# EAGLE design FeatherLargePrototype (EAGLE 7.4.0)
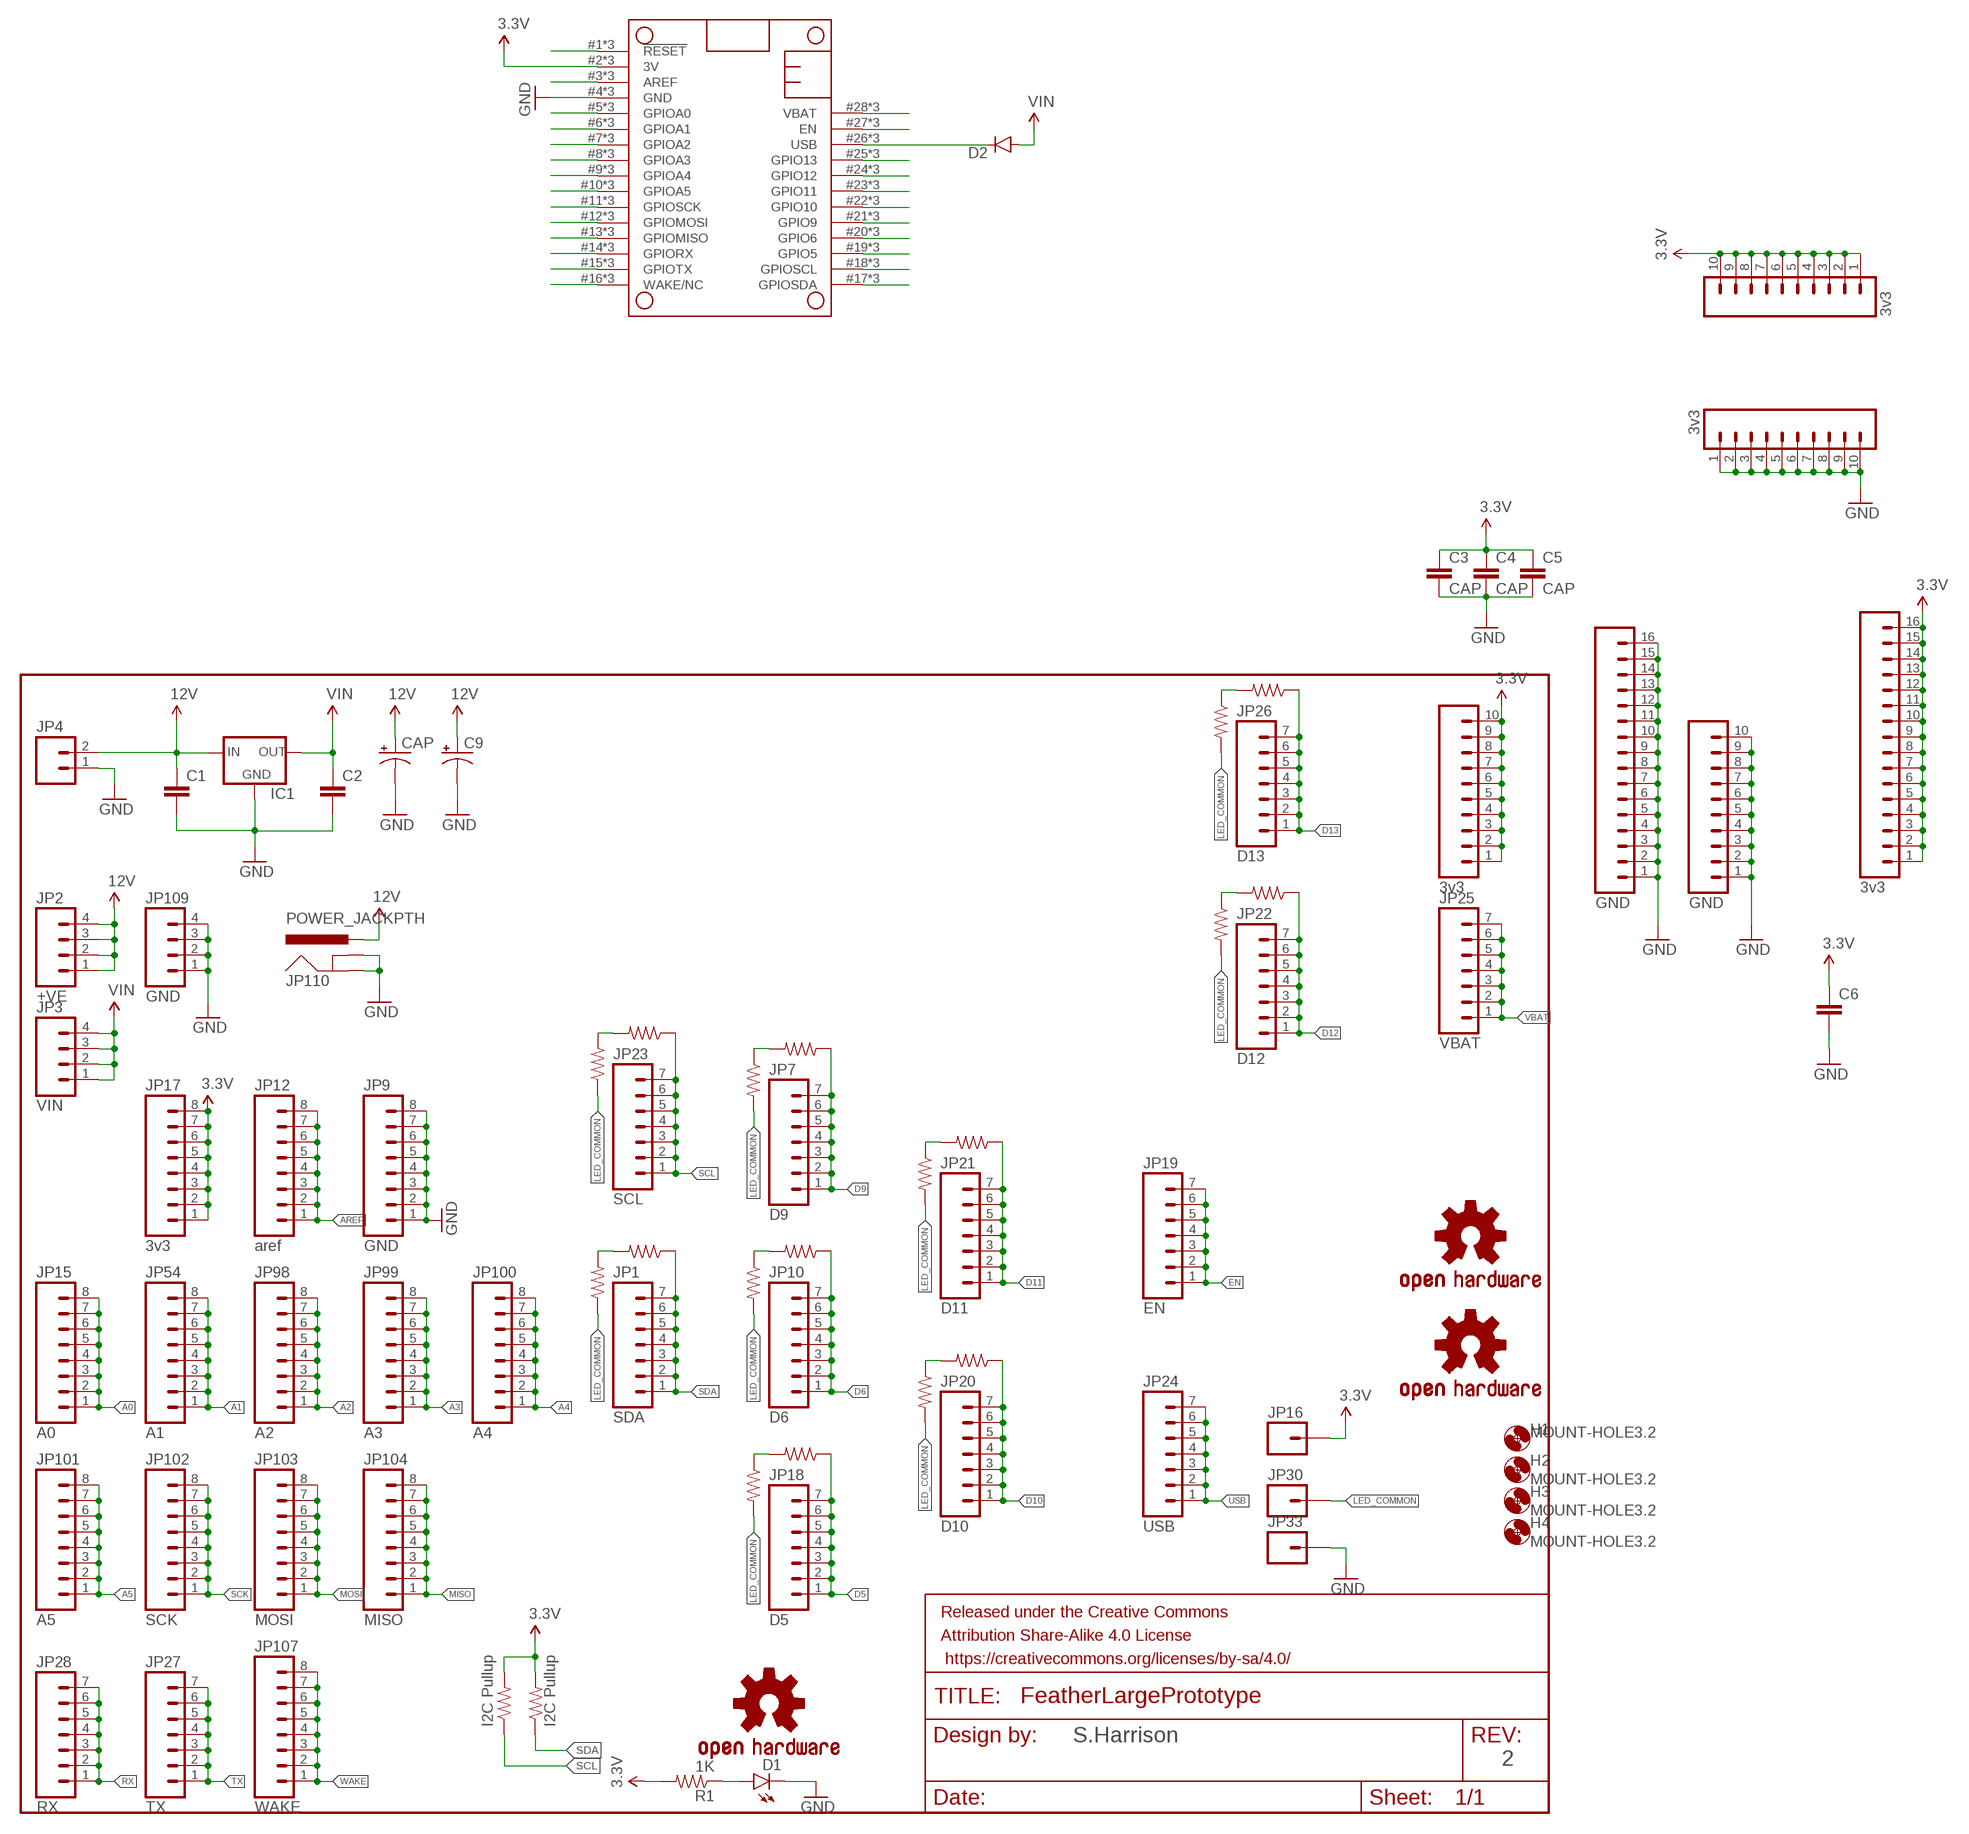
[diagram p0: schematic, sheet 1, part 1 of 2]
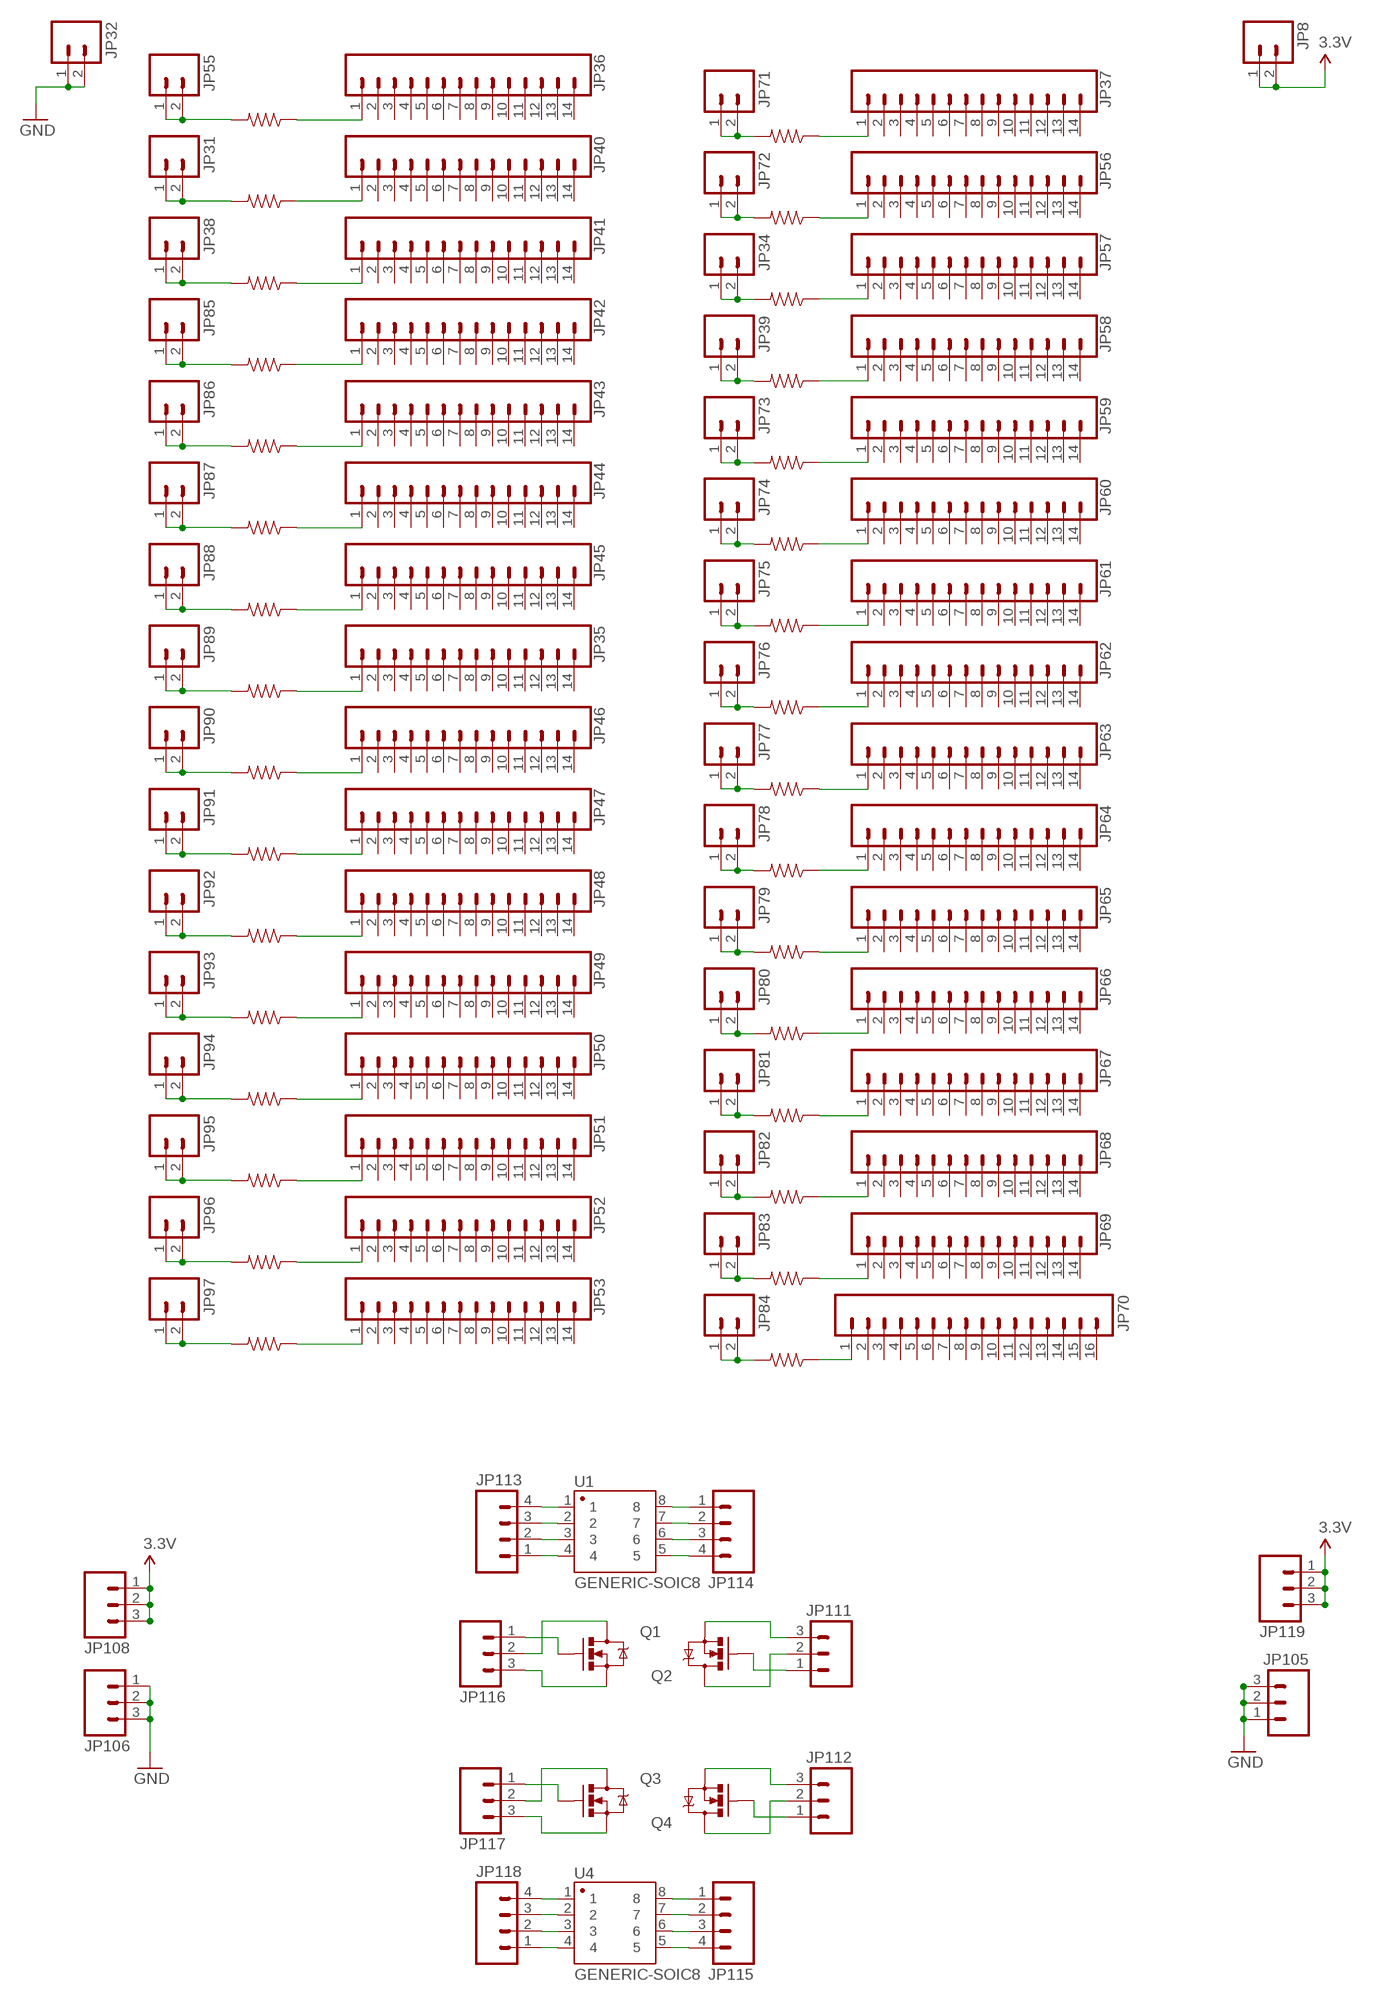
[diagram p1: schematic, sheet 1, part 2 of 2]

## Parts
C1  CAP1206  [1206]
C2  CAP1206  [1206]
C3  CAP  CAP1206  [1206]
C4  CAP  CAP1206  [1206]
C5  CAP  CAP1206  [1206]
C6  CAP1206  [1206]
C9  CAP_POL7343  [EIA7343]
CAP  CAP_POLPTH1  [CPOL-RADIAL-100UF-25V]
D1  LED1206-BOTTOM  [LED-1206-BOTTOM]
D2  DIODESMA-ALT  [SMA-DIODE_ALT]
FRAME1  FRAME-LETTER  [CREATIVE_COMMONS]
H1  MOUNT-HOLE3.2  [3,2]
H2  MOUNT-HOLE3.2  [3,2]
H3  MOUNT-HOLE3.2  [3,2]
H4  MOUNT-HOLE3.2  [3,2]
IC1  78XXS  [78XXS]
JP1  SDA  M07  [1X07]
JP2  +VE  M04PTH  [1X04]
JP3  VIN  M04PTH  [1X04]
JP4  M025MM  [SCREWTERMINAL-5MM-2]
JP5  3v3  M10SILK_FEMALE_PTH  [1X10]
JP6  3v3  M10SILK_FEMALE_PTH  [1X10]
JP7  D9  M07  [1X07]
JP8  M02PTH  [1X02]
JP9  GND  M08  [1X08_ROUND]
JP10  D6  M07  [1X07]
JP11  GND  M10SILK_FEMALE_PTH  [1X10]
JP12  aref  M08  [1X08_ROUND]
JP13  3v3  M16PTH  [1X16]
JP14  GND  M16PTH  [1X16]
JP15  A0  M08  [1X08_ROUND]
JP16  M01PTH  [1X01]
JP17  3v3  M08  [1X08_ROUND]
JP18  D5  M07  [1X07]
JP19  EN  M07  [1X07]
JP20  D10  M07  [1X07]
JP21  D11  M07  [1X07]
JP22  D12  M07  [1X07]
JP23  SCL  M07  [1X07]
JP24  USB  M07  [1X07]
JP25  VBAT  M07  [1X07]
JP26  D13  M07  [1X07]
JP27  TX  M07  [1X07]
JP28  RX  M07  [1X07]
JP29  3v3  M10SILK_FEMALE_PTH  [1X10]
JP30  M01PTH  [1X01]
JP31  M02PTH  [1X02]
JP32  M02PTH  [1X02]
JP33  M01PTH  [1X01]
JP34  M02PTH  [1X02]
JP35  CONN_14CONNECTED  [1X14_CONNECTED]
JP36  CONN_14CONNECTED  [1X14_CONNECTED]
JP37  CONN_14CONNECTED  [1X14_CONNECTED]
JP38  M02PTH  [1X02]
JP39  M02PTH  [1X02]
JP40  CONN_14CONNECTED  [1X14_CONNECTED]
JP41  CONN_14CONNECTED  [1X14_CONNECTED]
JP42  CONN_14CONNECTED  [1X14_CONNECTED]
JP43  CONN_14CONNECTED  [1X14_CONNECTED]
JP44  CONN_14CONNECTED  [1X14_CONNECTED]
JP45  CONN_14CONNECTED  [1X14_CONNECTED]
JP46  CONN_14CONNECTED  [1X14_CONNECTED]
JP47  CONN_14CONNECTED  [1X14_CONNECTED]
JP48  CONN_14CONNECTED  [1X14_CONNECTED]
JP49  CONN_14CONNECTED  [1X14_CONNECTED]
JP50  CONN_14CONNECTED  [1X14_CONNECTED]
JP51  CONN_14CONNECTED  [1X14_CONNECTED]
JP52  CONN_14CONNECTED  [1X14_CONNECTED]
JP53  CONN_14NO_SILK  [1X14_NO_SILK]
JP54  A1  M08  [1X08_ROUND]
JP55  M02PTH  [1X02]
JP56  CONN_14CONNECTED  [1X14_CONNECTED]
JP57  CONN_14CONNECTED  [1X14_CONNECTED]
JP58  CONN_14CONNECTED  [1X14_CONNECTED]
JP59  CONN_14CONNECTED  [1X14_CONNECTED]
JP60  CONN_14CONNECTED  [1X14_CONNECTED]
JP61  CONN_14CONNECTED  [1X14_CONNECTED]
JP62  CONN_14CONNECTED  [1X14_CONNECTED]
JP63  CONN_14CONNECTED  [1X14_CONNECTED]
JP64  CONN_14CONNECTED  [1X14_CONNECTED]
JP65  CONN_14CONNECTED  [1X14_CONNECTED]
JP66  CONN_14CONNECTED  [1X14_CONNECTED]
JP67  CONN_14CONNECTED  [1X14_CONNECTED]
JP68  CONN_14CONNECTED  [1X14_CONNECTED]
JP69  CONN_14CONNECTED  [1X14_CONNECTED]
JP70  M161X16_NO_SILK  [1X16_NO_SILK]
JP71  M02PTH  [1X02]
JP72  M02PTH  [1X02]
JP73  M02PTH  [1X02]
JP74  M02PTH  [1X02]
JP75  M02PTH  [1X02]
JP76  M02PTH  [1X02]
JP77  M02PTH  [1X02]
JP78  M02PTH  [1X02]
JP79  M02PTH  [1X02]
JP80  M02PTH  [1X02]
JP81  M02PTH  [1X02]
JP82  M02PTH  [1X02]
JP83  M02PTH  [1X02]
JP84  M02PTH  [1X02]
JP85  M02PTH  [1X02]
JP86  M02PTH  [1X02]
JP87  M02PTH  [1X02]
JP88  M02PTH  [1X02]
JP89  M02PTH  [1X02]
JP90  M02PTH  [1X02]
JP91  M02PTH  [1X02]
JP92  M02PTH  [1X02]
JP93  M02PTH  [1X02]
JP94  M02PTH  [1X02]
JP95  M02PTH  [1X02]
JP96  M02PTH  [1X02]
JP97  M02PTH  [1X02]
JP98  A2  M08  [1X08_ROUND]
JP99  A3  M08  [1X08_ROUND]
JP100  A4  M08  [1X08_ROUND]
JP101  A5  M08  [1X08_ROUND]
JP102  SCK  M08  [1X08_ROUND]
JP103  MOSI  M08  [1X08_ROUND]
JP104  MISO  M08  [1X08_ROUND]
JP105  M03PTH  [1X03]
JP106  M03PTH  [1X03]
JP107  WAKE  M08  [1X08_ROUND]
JP108  M03PTH  [1X03]
JP109  GND  M04PTH  [1X04]
JP110  POWER_JACKPTH  [POWER_JACK_PTH]
JP111  M03PTH  [1X03]
JP112  M03PTH  [1X03]
JP113  M04NO_SILK_ALL_ROUND  [1X04_NO_SILK_ALL_ROUND]
JP114  M04NO_SILK_ALL_ROUND  [1X04_NO_SILK_ALL_ROUND]
JP115  M04NO_SILK_ALL_ROUND  [1X04_NO_SILK_ALL_ROUND]
JP116  M03PTH  [1X03]
JP117  M03PTH  [1X03]
JP118  M04NO_SILK_ALL_ROUND  [1X04_NO_SILK_ALL_ROUND]
JP119  M03PTH  [1X03]
LOGO1  OSHW-LOGOL  [OSHW-LOGO-L]
LOGO2  OSHW-LOGOL  [OSHW-LOGO-L]
LOGO3  OSHW-LOGOM  [OSHW-LOGO-M]
MS2  FEATHERWINGFEATHEWING_BREAKOUT  [FEATHERWING_BREAKOUT]
Q1  MOSFET-NCHANNELBSS123LT1G  [SOT23-3]
Q2  MOSFET-NCHANNELBSS123LT1G  [SOT23-3]
Q3  MOSFET-NCHANNELBSS123LT1G  [SOT23-3]
Q4  MOSFET-NCHANNELBSS123LT1G  [SOT23-3]
R1  1K  RESISTOR1206  [1206]
R10  RESISTOR1206  [1206]
R11  RESISTOR1206  [1206]
R12  RESISTOR1206  [1206]
R13  RESISTOR1206  [1206]
R14  RESISTOR1206  [1206]
R15  RESISTOR1206  [1206]
R16  RESISTOR1206  [1206]
R17  RESISTOR1206  [1206]
R18  RESISTOR1206  [1206]
R19  RESISTOR1206  [1206]
R20  RESISTOR1206  [1206]
R21  RESISTOR1206  [1206]
R22  RESISTOR1206  [1206]
R23  RESISTOR1206  [1206]
R24  RESISTOR1206  [1206]
R25  RESISTOR1206  [1206]
R26  RESISTOR1206  [1206]
R27  RESISTOR1206  [1206]
R30  RESISTOR1206  [1206]
R31  RESISTOR1206  [1206]
R32  RESISTOR1206  [1206]
R33  RESISTOR1206  [1206]
R34  RESISTOR1206  [1206]
R35  RESISTOR1206  [1206]
R36  RESISTOR1206  [1206]
R37  RESISTOR1206  [1206]
R38  RESISTOR1206  [1206]
R39  RESISTOR1206  [1206]
R40  RESISTOR1206  [1206]
R41  RESISTOR1206  [1206]
R42  RESISTOR1206  [1206]
R43  RESISTOR1206  [1206]
R44  RESISTOR1206  [1206]
R45  RESISTOR1206  [1206]
R46  RESISTOR1206  [1206]
R47  RESISTOR1206  [1206]
R48  RESISTOR1206  [1206]
R49  RESISTOR1206  [1206]
R50  RESISTOR1206  [1206]
R51  RESISTOR1206  [1206]
R52  RESISTOR1206  [1206]
R53  RESISTOR1206  [1206]
R54  RESISTOR1206  [1206]
R55  RESISTOR1206  [1206]
R56  RESISTOR1206  [1206]
R57  RESISTOR1206  [1206]
R58  RESISTOR1206  [1206]
R59  RESISTOR1206  [1206]
R60  RESISTOR1206  [1206]
R61  RESISTOR1206  [1206]
R62  I2C Pullup  RESISTOR1206  [1206]
R63  I2C Pullup  RESISTOR1206  [1206]
U1  GENERIC-SOIC8  [SO08-UNIVERSAL]
U4  GENERIC-SOIC8  [SO08-UNIVERSAL]

## Nets
3.3V: C3.1 C4.1 C5.1 C6.1 JP5.1 JP5.2 JP5.3 JP5.4 JP5.5 JP5.6 JP5.7 JP5.8 JP5.9 JP5.10 JP6.1 JP6.2 JP6.3 JP6.4 JP6.5 JP6.6 JP6.7 JP6.8 JP6.9 JP6.10 JP8.1 JP8.2 JP13.1 JP13.2 JP13.3 JP13.4 JP13.5 JP13.6 JP13.7 JP13.8 JP13.9 JP13.10 JP13.11 JP13.12 JP13.13 JP13.14 JP13.15 JP13.16 JP16.1 JP17.1 JP17.2 JP17.3 JP17.4 JP17.5 JP17.6 JP17.7 JP17.8 JP108.1 JP108.2 JP108.3 JP119.1 JP119.2 JP119.3 MS2.2(3V) MS2.#2(3V) MS2.@2(3V) R1.2 R62.2 R63.2
12V: C1.1 C9.A(+) CAP.1(+) IC1.IN JP2.1 JP2.2 JP2.3 JP2.4 JP4.2 JP110.PWR
A0: JP15.1 JP15.2 JP15.3 JP15.4 JP15.5 JP15.6 JP15.7 JP15.8 MS2.5(GPIOA0) MS2.#5(GPIOA0) MS2.@5(GPIOA0)
A1: JP54.1 JP54.2 JP54.3 JP54.4 JP54.5 JP54.6 JP54.7 JP54.8 MS2.6(GPIOA1) MS2.#6(GPIOA1) MS2.@6(GPIOA1)
A2: JP98.1 JP98.2 JP98.3 JP98.4 JP98.5 JP98.6 JP98.7 JP98.8 MS2.7(GPIOA2) MS2.#7(GPIOA2) MS2.@7(GPIOA2)
A3: JP99.1 JP99.2 JP99.3 JP99.4 JP99.5 JP99.6 JP99.7 JP99.8 MS2.8(GPIOA3) MS2.#8(GPIOA3) MS2.@8(GPIOA3)
A4: JP100.1 JP100.2 JP100.3 JP100.4 JP100.5 JP100.6 JP100.7 JP100.8 MS2.9(GPIOA4) MS2.#9(GPIOA4) MS2.@9(GPIOA4)
A5: JP101.1 JP101.2 JP101.3 JP101.4 JP101.5 JP101.6 JP101.7 JP101.8 MS2.10(GPIOA5) MS2.#10(GPIOA5) MS2.@10(GPIOA5)
AREF: JP12.1 JP12.2 JP12.3 JP12.4 JP12.5 JP12.6 JP12.7 JP12.8 MS2.3(AREF) MS2.#3(AREF) MS2.@3(AREF)
D5: JP18.1 JP18.2 JP18.3 JP18.4 JP18.5 JP18.6 JP18.7 MS2.19(GPIO5) MS2.#19(GPIO5) MS2.@19(GPIO5) R22.1
D6: JP10.1 JP10.2 JP10.3 JP10.4 JP10.5 JP10.6 JP10.7 MS2.20(GPIO6) MS2.#20(GPIO6) MS2.@20(GPIO6) R20.1
D9: JP7.1 JP7.2 JP7.3 JP7.4 JP7.5 JP7.6 JP7.7 MS2.21(GPIO9) MS2.#21(GPIO9) MS2.@21(GPIO9) R18.1
D10: JP20.1 JP20.2 JP20.3 JP20.4 JP20.5 JP20.6 JP20.7 MS2.22(GPIO10) MS2.#22(GPIO10) MS2.@22(GPIO10) R16.1
D11: JP21.1 JP21.2 JP21.3 JP21.4 JP21.5 JP21.6 JP21.7 MS2.23(GPIO11) MS2.#23(GPIO11) MS2.@23(GPIO11) R14.1
D12: JP22.1 JP22.2 JP22.3 JP22.4 JP22.5 JP22.6 JP22.7 MS2.24(GPIO12) MS2.#24(GPIO12) MS2.@24(GPIO12) R12.1
D13: JP26.1 JP26.2 JP26.3 JP26.4 JP26.5 JP26.6 JP26.7 MS2.25(GPIO13) MS2.#25(GPIO13) MS2.@25(GPIO13) R10.1
EN: JP19.1 JP19.2 JP19.3 JP19.4 JP19.5 JP19.6 JP19.7 MS2.27(EN) MS2.#27(EN) MS2.@27(EN)
GND: C1.2 C2.2 C3.2 C4.2 C5.2 C6.2 C9.C(-) CAP.2(-) D1.C IC1.GND JP4.1 JP9.1 JP9.2 JP9.3 JP9.4 JP9.5 JP9.6 JP9.7 JP9.8 JP11.1 JP11.2 JP11.3 JP11.4 JP11.5 JP11.6 JP11.7 JP11.8 JP11.9 JP11.10 JP14.1 JP14.2 JP14.3 JP14.4 JP14.5 JP14.6 JP14.7 JP14.8 JP14.9 JP14.10 JP14.11 JP14.12 JP14.13 JP14.14 JP14.15 JP14.16 JP29.1 JP29.2 JP29.3 JP29.4 JP29.5 JP29.6 JP29.7 JP29.8 JP29.9 JP29.10 JP32.1 JP32.2 JP33.1 JP105.1 JP105.2 JP105.3 JP106.1 JP106.2 JP106.3 JP109.1 JP109.2 JP109.3 JP109.4 JP110.GND JP110.GNDBREAK MS2.4(GND) MS2.#4(GND) MS2.@4(GND)
LED_COMMON: JP30.1 R11.2 R13.2 R15.2 R17.2 R19.2 R21.2 R23.2 R25.1 R27.1
MISO: JP104.1 JP104.2 JP104.3 JP104.4 JP104.5 JP104.6 JP104.7 JP104.8 MS2.13(GPIOMISO) MS2.#13(GPIOMISO) MS2.@13(GPIOMISO)
MOSI: JP103.1 JP103.2 JP103.3 JP103.4 JP103.5 JP103.6 JP103.7 JP103.8 MS2.12(GPIOMOSI) MS2.#12(GPIOMOSI) MS2.@12(GPIOMOSI)
N$1: D1.A R1.1
N$2: JP113.4 U1.1
N$3: JP113.3 U1.2
N$6: R10.2 R11.1
N$7: JP113.2 U1.3
N$8: JP113.1 U1.4
N$9: JP114.1 U1.8
N$12: JP114.2 U1.7
N$13: R12.2 R13.1
N$14: R14.2 R15.1
N$15: R16.2 R17.1
N$16: JP114.3 U1.6
N$17: JP114.4 U1.5
N$18: JP112.3 Q4.2(S)
N$19: R18.2 R19.1
N$20: JP116.2 Q1.3(D)
N$21: R20.2 R21.1
N$22: JP116.1 Q1.1(G)
N$23: R22.2 R23.1
N$25: JP71.1 JP71.2 R46.2
N$26: JP116.3 Q1.2(S)
N$27: R26.2 R27.2
N$29: R24.2 R25.2
N$30: JP117.2 Q3.3(D)
N$31: JP72.1 JP72.2 R47.2
N$32: JP34.1 JP34.2 R48.2
N$33: JP39.1 JP39.2 R49.2
N$34: JP73.1 JP73.2 R50.2
N$35: JP74.1 JP74.2 R51.2
N$36: JP75.1 JP75.2 R52.2
N$37: JP76.1 JP76.2 R53.2
N$38: JP77.1 JP77.2 R54.2
N$39: JP78.1 JP78.2 R55.2
N$40: JP79.1 JP79.2 R56.2
N$41: JP80.1 JP80.2 R57.2
N$42: JP81.1 JP81.2 R58.2
N$43: JP82.1 JP82.2 R59.2
N$44: JP83.1 JP83.2 R60.2
N$45: JP84.1 JP84.2 R61.2
N$46: JP70.1 R61.1
N$47: JP69.1 R60.1
N$48: JP68.1 R59.1
N$49: JP67.1 R58.1
N$50: JP66.1 R57.1
N$51: JP65.1 R56.1
N$52: JP64.1 R55.1
N$53: JP63.1 R54.1
N$54: JP62.1 R53.1
N$55: JP61.1 R52.1
N$56: JP60.1 R51.1
N$57: JP59.1 R50.1
N$58: JP58.1 R49.1
N$59: JP57.1 R48.1
N$60: JP56.1 R47.1
N$61: JP37.1 R46.1
N$62: JP97.1 JP97.2 R45.2
N$63: JP96.1 JP96.2 R44.2
N$64: JP95.1 JP95.2 R43.2
N$65: JP94.1 JP94.2 R42.2
N$66: JP93.1 JP93.2 R41.2
N$67: JP92.1 JP92.2 R40.2
N$68: JP91.1 JP91.2 R39.2
N$69: JP90.1 JP90.2 R38.2
N$70: JP89.1 JP89.2 R37.2
N$71: JP88.1 JP88.2 R36.2
N$72: JP87.1 JP87.2 R35.2
N$73: JP86.1 JP86.2 R34.2
N$74: JP85.1 JP85.2 R33.2
N$75: JP38.1 JP38.2 R32.2
N$76: JP55.1 JP55.2 R30.2
N$77: JP36.1 R30.1
N$78: JP40.1 R31.1
N$79: JP41.1 R32.1
N$80: JP42.1 R33.1
N$81: JP43.1 R34.1
N$82: JP44.1 R35.1
N$83: JP45.1 R36.1
N$84: JP35.1 R37.1
N$85: JP46.1 R38.1
N$86: JP47.1 R39.1
N$87: JP48.1 R40.1
N$88: JP49.1 R41.1
N$89: JP50.1 R42.1
N$90: JP51.1 R43.1
N$91: JP52.1 R44.1
N$92: JP53.1 R45.1
N$93: JP31.1 JP31.2 R31.2
N$95: JP117.1 Q3.1(G)
N$96: JP117.3 Q3.2(S)
N$97: JP118.4 U4.1
N$98: JP118.3 U4.2
N$104: JP118.2 U4.3
N$128: JP118.1 U4.4
N$129: JP115.1 U4.8
N$130: JP115.2 U4.7
N$131: JP115.3 U4.6
N$132: JP115.4 U4.5
N$134: JP112.2 Q4.3(D)
N$135: JP112.1 Q4.1(G)
N$138: JP111.2 Q2.3(D)
N$139: JP111.1 Q2.1(G)
N$140: JP111.3 Q2.2(S)
RESET: MS2.1(!RESET) MS2.#1(!RESET) MS2.@1(!RESET)
RX: JP28.1 JP28.2 JP28.3 JP28.4 JP28.5 JP28.6 JP28.7 MS2.14(GPIORX) MS2.#14(GPIORX) MS2.@14(GPIORX)
SCK: JP102.1 JP102.2 JP102.3 JP102.4 JP102.5 JP102.6 JP102.7 JP102.8 MS2.11(GPIOSCK) MS2.#11(GPIOSCK) MS2.@11(GPIOSCK)
SCL: JP23.1 JP23.2 JP23.3 JP23.4 JP23.5 JP23.6 JP23.7 MS2.18(GPIOSCL) MS2.#18(GPIOSCL) MS2.@!8(GPIOSCL) R24.1 R62.1
SDA: JP1.1 JP1.2 JP1.3 JP1.4 JP1.5 JP1.6 JP1.7 MS2.17(GPIOSDA) MS2.#17(GPIOSDA) MS2.@17(GPIOSDA) R26.1 R63.1
TX: JP27.1 JP27.2 JP27.3 JP27.4 JP27.5 JP27.6 JP27.7 MS2.15(GPIOTX) MS2.#15(GPIOTX) MS2.@15(GPIOTX)
USB: D2.C JP24.1 JP24.2 JP24.3 JP24.4 JP24.5 JP24.6 JP24.7 MS2.26(USB) MS2.#26(USB) MS2.@26(USB)
VBAT: JP25.1 JP25.2 JP25.3 JP25.4 JP25.5 JP25.6 JP25.7 MS2.28(VBAT) MS2.#28(VBAT) MS2.@28(VBAT)
VIN: C2.1 D2.A IC1.OUT JP3.1 JP3.2 JP3.3 JP3.4
WAKE: JP107.1 JP107.2 JP107.3 JP107.4 JP107.5 JP107.6 JP107.7 JP107.8 MS2.16(WAKE/NC) MS2.#16(WAKE/NC) MS2.@16(WAKE/NC)
Unconnected: JP35.2 JP35.3 JP35.4 JP35.5 JP35.6 JP35.7 JP35.8 JP35.9 JP35.10 JP35.11 JP35.12 JP35.13 JP35.14 JP36.2 JP36.3 JP36.4 JP36.5 JP36.6 JP36.7 JP36.8 JP36.9 JP36.10 JP36.11 JP36.12 JP36.13 JP36.14 JP37.2 JP37.3 JP37.4 JP37.5 JP37.6 JP37.7 JP37.8 JP37.9 JP37.10 JP37.11 JP37.12 JP37.13 JP37.14 JP40.2 JP40.3 JP40.4 JP40.5 JP40.6 JP40.7 JP40.8 JP40.9 JP40.10 JP40.11 JP40.12 JP40.13 JP40.14 JP41.2 JP41.3 JP41.4 JP41.5 JP41.6 JP41.7 JP41.8 JP41.9 JP41.10 JP41.11 JP41.12 JP41.13 JP41.14 JP42.2 JP42.3 JP42.4 JP42.5 JP42.6 JP42.7 JP42.8 JP42.9 JP42.10 JP42.11 JP42.12 JP42.13 JP42.14 JP43.2 JP43.3 JP43.4 JP43.5 JP43.6 JP43.7 JP43.8 JP43.9 JP43.10 JP43.11 JP43.12 JP43.13 JP43.14 JP44.2 JP44.3 JP44.4 JP44.5 JP44.6 JP44.7 JP44.8 JP44.9 JP44.10 JP44.11 JP44.12 JP44.13 JP44.14 JP45.2 JP45.3 JP45.4 JP45.5 JP45.6 JP45.7 JP45.8 JP45.9 JP45.10 JP45.11 JP45.12 JP45.13 JP45.14 JP46.2 JP46.3 JP46.4 JP46.5 JP46.6 JP46.7 JP46.8 JP46.9 JP46.10 JP46.11 JP46.12 JP46.13 JP46.14 JP47.2 JP47.3 JP47.4 JP47.5 JP47.6 JP47.7 JP47.8 JP47.9 JP47.10 JP47.11 JP47.12 JP47.13 JP47.14 JP48.2 JP48.3 JP48.4 JP48.5 JP48.6 JP48.7 JP48.8 JP48.9 JP48.10 JP48.11 JP48.12 JP48.13 JP48.14 JP49.2 JP49.3 JP49.4 JP49.5 JP49.6 JP49.7 JP49.8 JP49.9 JP49.10 JP49.11 JP49.12 JP49.13 JP49.14 JP50.2 JP50.3 JP50.4 JP50.5 JP50.6 JP50.7 JP50.8 JP50.9 JP50.10 JP50.11 JP50.12 JP50.13 JP50.14 JP51.2 JP51.3 JP51.4 JP51.5 JP51.6 JP51.7 JP51.8 JP51.9 JP51.10 JP51.11 JP51.12 JP51.13 JP51.14 JP52.2 JP52.3 JP52.4 JP52.5 JP52.6 JP52.7 JP52.8 JP52.9 JP52.10 JP52.11 JP52.12 JP52.13 JP52.14 JP53.2 JP53.3 JP53.4 JP53.5 JP53.6 JP53.7 JP53.8 JP53.9 JP53.10 JP53.11 JP53.12 JP53.13 JP53.14 JP56.2 JP56.3 JP56.4 JP56.5 JP56.6 JP56.7 JP56.8 JP56.9 JP56.10 JP56.11 JP56.12 JP56.13 JP56.14 JP57.2 JP57.3 JP57.4 JP57.5 JP57.6 JP57.7 JP57.8 JP57.9 JP57.10 JP57.11 JP57.12 JP57.13 JP57.14 JP58.2 JP58.3 JP58.4 JP58.5 JP58.6 JP58.7 JP58.8 JP58.9 JP58.10 JP58.11 JP58.12 JP58.13 JP58.14 JP59.2 JP59.3 JP59.4 JP59.5 JP59.6 JP59.7 JP59.8 JP59.9 JP59.10 JP59.11 JP59.12 JP59.13 JP59.14 JP60.2 JP60.3 JP60.4 JP60.5 JP60.6 JP60.7 JP60.8 JP60.9 JP60.10 JP60.11 JP60.12 JP60.13 JP60.14 JP61.2 JP61.3 JP61.4 JP61.5 JP61.6 JP61.7 JP61.8 JP61.9 JP61.10 JP61.11 JP61.12 JP61.13 JP61.14 JP62.2 JP62.3 JP62.4 JP62.5 JP62.6 JP62.7 JP62.8 JP62.9 JP62.10 JP62.11 JP62.12 JP62.13 JP62.14 JP63.2 JP63.3 JP63.4 JP63.5 JP63.6 JP63.7 JP63.8 JP63.9 JP63.10 JP63.11 JP63.12 JP63.13 JP63.14 JP64.2 JP64.3 JP64.4 JP64.5 JP64.6 JP64.7 JP64.8 JP64.9 JP64.10 JP64.11 JP64.12 JP64.13 JP64.14 JP65.2 JP65.3 JP65.4 JP65.5 JP65.6 JP65.7 JP65.8 JP65.9 JP65.10 JP65.11 JP65.12 JP65.13 JP65.14 JP66.2 JP66.3 JP66.4 JP66.5 JP66.6 JP66.7 JP66.8 JP66.9 JP66.10 JP66.11 JP66.12 JP66.13 JP66.14 JP67.2 JP67.3 JP67.4 JP67.5 JP67.6 JP67.7 JP67.8 JP67.9 JP67.10 JP67.11 JP67.12 JP67.13 JP67.14 JP68.2 JP68.3 JP68.4 JP68.5 JP68.6 JP68.7 JP68.8 JP68.9 JP68.10 JP68.11 JP68.12 JP68.13 JP68.14 JP69.2 JP69.3 JP69.4 JP69.5 JP69.6 JP69.7 JP69.8 JP69.9 JP69.10 JP69.11 JP69.12 JP69.13 JP69.14 JP70.2 JP70.3 JP70.4 JP70.5 JP70.6 JP70.7 JP70.8 JP70.9 JP70.10 JP70.11 JP70.12 JP70.13 JP70.14 JP70.15 JP70.16

## Notes on the sheet
- S.Harrison
- 2

## Library data of the parts
C1-C6 = SparkFun-Capacitors:CAP: Capacitor Standard 0603 ceramic capacitor, and 0.1" leaded capacitor.
C9 = SparkFun-Capacitors:CAP_POL: Capacitor Polarized These are standard SMD and PTH capacitors. Normally 10uF, 47uF, and 100uF in electrolytic and tantalum varieties. Always verify the external diameter of the through hole cap, it varies with capacity, voltage, and manufacturer. The EIA devices should be standard.; PROD_ID: CAP-08702
CAP = SparkFun-Capacitors:CAP_POL: Capacitor Polarized These are standard SMD and PTH capacitors. Normally 10uF, 47uF, and 100uF in electrolytic and tantalum varieties. Always verify the external diameter of the through hole cap, it varies with capacity, voltage, and manufacturer. The EIA devices should be standard.
D1 = SparkFun-LED:LED: LEDs Standard schematic elements and footprints for 5mm, 3mm, 1206, and 0603 sized LEDs. 5mm - Spark Fun Electronics SKU : COM-00529 (and others)
D2 = SparkFun-DiscreteSemi:DIODE: Diode These are standard reverse protection diodes and small signal diodes. SMA package can handle up to about 1A. SOD-323 can handle about 200mA. What the SOD-323 package when ordering, there are some mfgs out there that are 5-pin packages.
FRAME1 = SparkFun-Aesthetics:FRAME-LETTER: Schematic Frame Standard 8.5x11 US Letter frame
H1-H4 = holes:MOUNT-HOLE: MOUNTING HOLE with drill center marker
IC1 = v-reg:78XXS: VOLTAGE REGULATOR
JP1 JP7 JP10 JP18-JP28 = SparkFun-Connectors:M07: Header 7 Standard 7-pin 0.1" header. Use with straight break away headers (SKU : PRT-00116), right angle break away headers (PRT-00553), swiss pins (PRT-00743), machine pins (PRT-00117), and female headers (PRT-00115). NOTES ON THE VARIANTS LOCK and LOCK_LONGPADS... This footprint was designed to help hold the alignment of a through-hole component (i.e. 7-pin header) while soldering it into place. You may notice that each hole has been shifted either up or down by 0.005 of an inch from it's more standard position (which is usually a perfectly straight line). This slight alteration caused the pins (the squares in the middle) to touch the edges of the holes. Because they are alternating, it causes a "brace" to hold the header in place. 0.005 has proven to be the perfect amount of "off-center" position when using our standard breakaway headers. Although looks a little odd when you look at the bare footprint, once you have a header in there, the alteration is very hard to notice. Also, if you push a header all the way into place, it is covered up entirely on the bottom side. This idea of altering the position of holes to aid alignment will be further integrated into the Sparkfun Library for other footprints. It can help hold any component with 3 or more connection pins.
JP2 JP3 JP109 JP113-JP115 JP118 = SparkFun-Connectors:M04: Header 4 Standard 4-pin 0.1" header. Use with straight break away headers (SKU : PRT-00116), right angle break away headers (PRT-00553), swiss pins (PRT-00743), machine pins (PRT-00117), and female headers (PRT-00115). Molex polarized connector foot print use with SKU : PRT-08231 with associated crimp pins and housings. 1MM SMD Version SKU: PRT-10208
JP4 = SparkFun-Connectors:M02: Standard 2-pin 0.1" header. Use with - straight break away headers ( PRT-00116) - right angle break away headers (PRT-00553) - swiss pins (PRT-00743) - machine pins (PRT-00117) - female headers (PRT-00115) Molex polarized connector foot print use with: PRT-08233 with associated crimp pins and housings. 2.54_SCREWTERM for use with PRT-10571. 3.5mm Screw Terminal footprints for PRT-08084 5mm Screw Terminal footprints for use with PRT-08432; STOREFRONT_ID: PRT-08432
JP5 JP6 JP11 JP29 = SparkFun-Connectors:M10: Header 10 Standard 10-pin 0.1" header. Use with straight break away headers (SKU : PRT-00116), right angle break away headers (PRT-00553), swiss pins (PRT-00743), machine pins (PRT-00117), and female headers (PRT-00115).; PROD_ID: CONN-11563
JP8 JP31 JP32 JP34 JP38 JP39 JP55 JP71-JP97 = SparkFun-Connectors:M02: Standard 2-pin 0.1" header. Use with - straight break away headers ( PRT-00116) - right angle break away headers (PRT-00553) - swiss pins (PRT-00743) - machine pins (PRT-00117) - female headers (PRT-00115) Molex polarized connector foot print use with: PRT-08233 with associated crimp pins and housings. 2.54_SCREWTERM for use with PRT-10571. 3.5mm Screw Terminal footprints for PRT-08084 5mm Screw Terminal footprints for use with PRT-08432
JP9 JP12 JP15 JP17 JP54 JP98-JP104 JP107 = SparkFun-Connectors:M08: Header 8 Standard 8-pin 0.1" header. Use with straight break away headers (SKU : PRT-00116), right angle break away headers (PRT-00553), swiss pins (PRT-00743), machine pins (PRT-00117), and female headers (PRT-00115).
JP13 JP14 JP70 = SparkFun-Connectors:M16: 1x16 .1" header
JP16 JP30 JP33 = SparkFun-Connectors:M01: Header 1 Standard 1-pin 0.1" header. Use with straight break away headers (SKU : PRT-00116), right angle break away headers (PRT-00553), swiss pins (PRT-00743), machine pins (PRT-00117), and female headers (PRT-00115).
JP35-JP37 JP40-JP53 JP56-JP69 = ThingySticks:CONN_14: Multi connection point. Often used as Generic Header-pin footprint for 0.1 inch spaced/style header connections On any of the 0.1 inch spaced packages, you can populate with these: Break Away Headers - Straight <https://www.sparkfun.com/products/116> (PRT-00116) Break Away Male Headers - Right Angle <https://www.sparkfun.com/products/553> (PRT-00553) Female Headers <https://www.sparkfun.com/products/115> (PRT-00115) Break Away Headers - Machine Pin <https://www.sparkfun.com/products/117> (PRT-00117) Break Away Female Headers - Swiss Machine Pin <https://www.sparkfun.com/products/743> (PRT-00743) For SCREWTERMINALS and SPRING TERMINALS visit here: Screw Terimnals on SparkFun.com <https://www.sparkfun.com/search/results?term=Screw+Terminals> (5mm/3.5mm/2.54mm spacing) This device is also useful as a general connection point to wire up your design to another part of your project. Our various solder wires solder well into these plated through hole pads. Hook-Up Wire - Assortment (Stranded, 22 AWG) <https://www.sparkfun.com/products/11375> (PRT-11375) Hook-Up Wire - Assortment (Solid Core, 22 AWG) <https://www.sparkfun.com/products/11367> (PRT-11367) View the entire wire category on our website here <https://www.sparkfun.com/categories/141> Special notes: Molex polarized connector foot print use with SKU : PRT-08231 with associated crimp pins and housings. 1MM SMD Version SKU: PRT-10208 NOTES ON THE VARIANTS LOCK and LOCK_LONGPADS... This footprint was designed to help hold the alignment of a through-hole component (i.e. 6-pin header) while soldering it into place. You may notice that each hole has been shifted either up or down by 0.005 of an inch from it's more standard position (which is a perfectly straight line). This slight alteration caused the pins (the squares in the middle) to touch the edges of the holes. Because they are alternating, it causes a "brace" to hold the component in place. 0.005 has proven to be the perfect amount of "off-center" position when using our standard breakaway headers. Although looks a little odd when you look at the bare footprint, once you have a header in there, the alteration is very hard to notice. Also,if you push a header all the way into place, it is covered up entirely on the bottom side.
JP105 JP106 JP108 JP111 JP112 JP116 JP117 JP119 = SparkFun-Connectors:M03: Header 3 Standard 3-pin 0.1" header. Use with straight break away headers (SKU : PRT-00116), right angle break away headers (PRT-00553), swiss pins (PRT-00743), machine pins (PRT-00117), and female headers (PRT-00115). Molex polarized connector foot print use with SKU : PRT-08232 with associated crimp pins and housings.
JP110 = SparkFun-Connectors:POWER_JACK: Power Jack This is the standard 5.5mm barrel jack for power. The PTH is the most common, proven, reliable, footprint. The Slot footprint only works if the mill layer is transmitted to the PCB fab house so be warned. Mating wall wart : TOL-00298 (and others); PROD_ID: CONN-08197
LOGO1-LOGO3 = SparkFun-Aesthetics:OSHW-LOGO: Open Source Hardware Logo This logo indicates the piece of hardware it is found on incorporates a OSHW license and/or adheres to the definition of open source hardware found here: http://freedomdefined.org/OSHW
MS2 = ThingySticks:FEATHERWING
Q1-Q4 = SparkFun-DiscreteSemi:MOSFET-NCHANNEL: Common NMOSFET Parts MFG P/N Store ID Prod ID FDD8780 TRANS-09984 SI7820DN TRANS-11055 FDS6630A IC-08089 2N7002PW TRANS-11151 FQP30N06L COM-10213 TRANS-10060 BSS123LT1G TRANS-08345 BSS138 TRANS-00830 BS170 2N7000; PROD_ID: TRANS-08345
R1 R10-R27 R30-R63 = SparkFun-Resistors:RESISTOR: Resistor Basic schematic elements and footprints for 0603, 1206, and PTH resistors.
U1 U4 = SparkFun-AnalogIC:GENERIC-SOIC8: A placeholder for generic narrow & wide SOIC8 foorptints - used on the DIP adapter board.

## Board
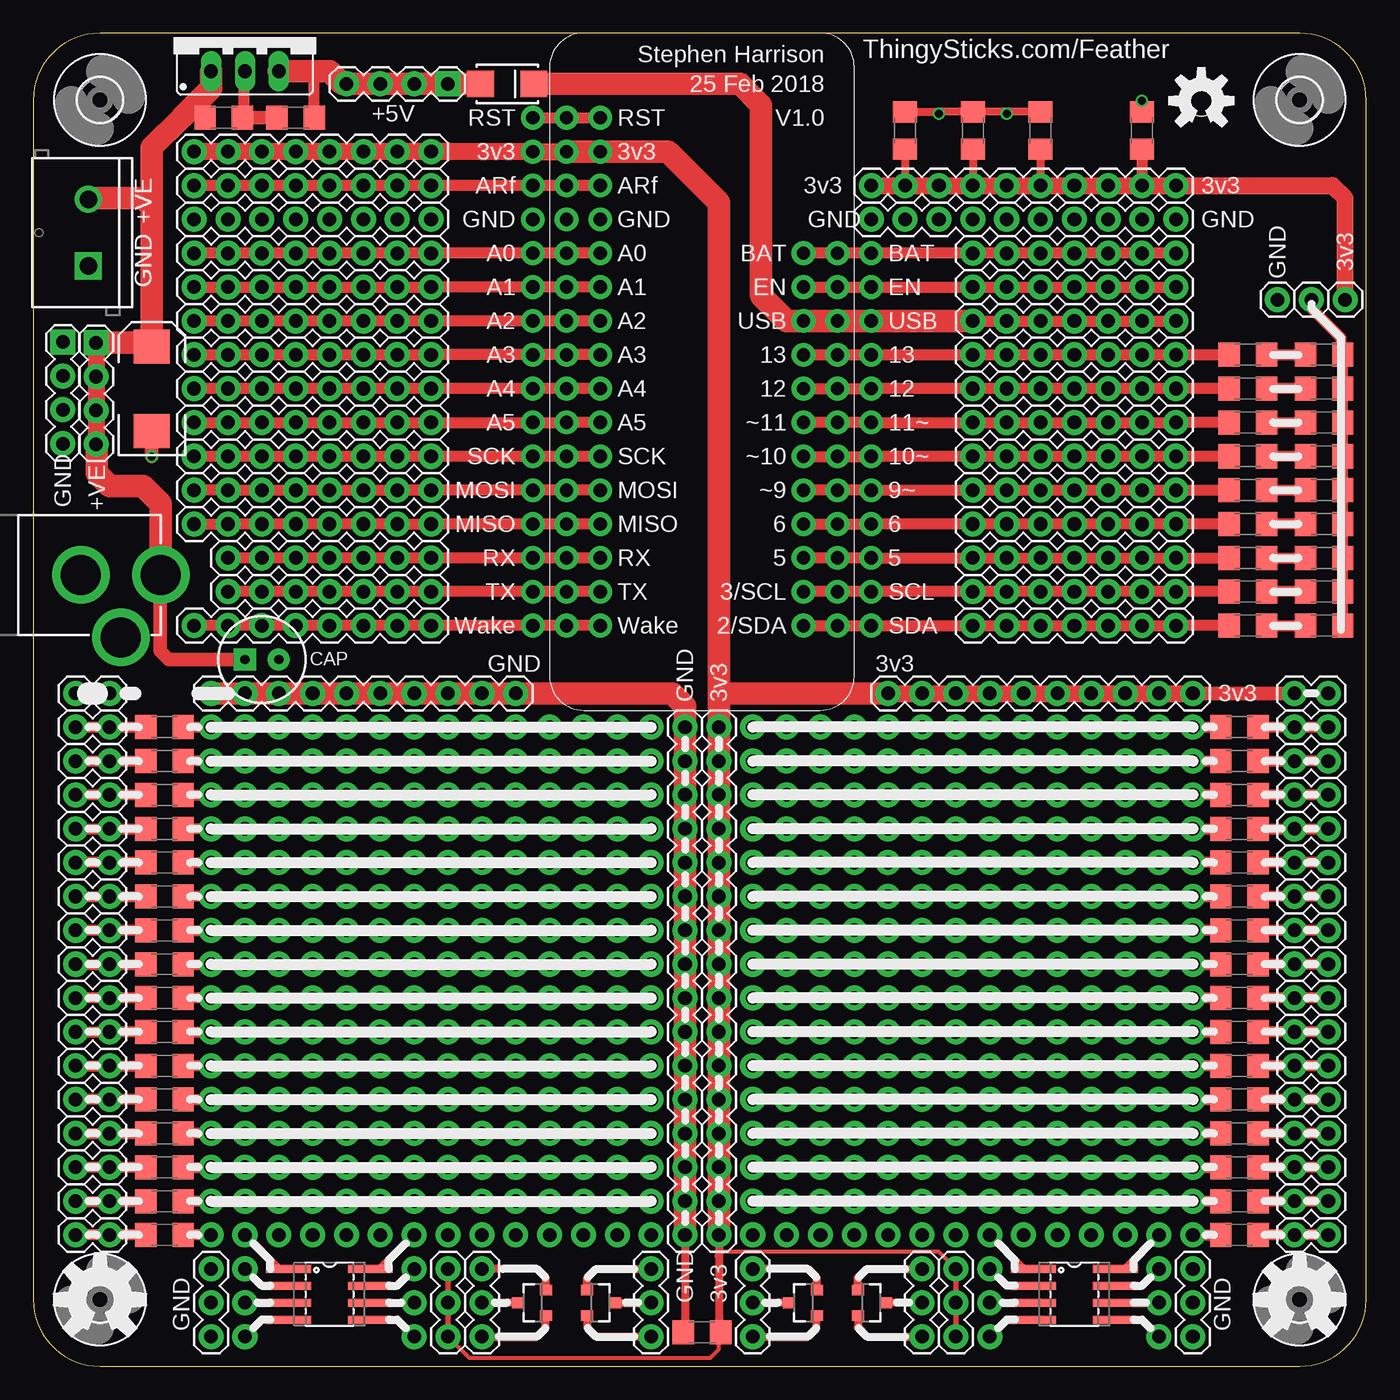
[diagram p2: board, top side]
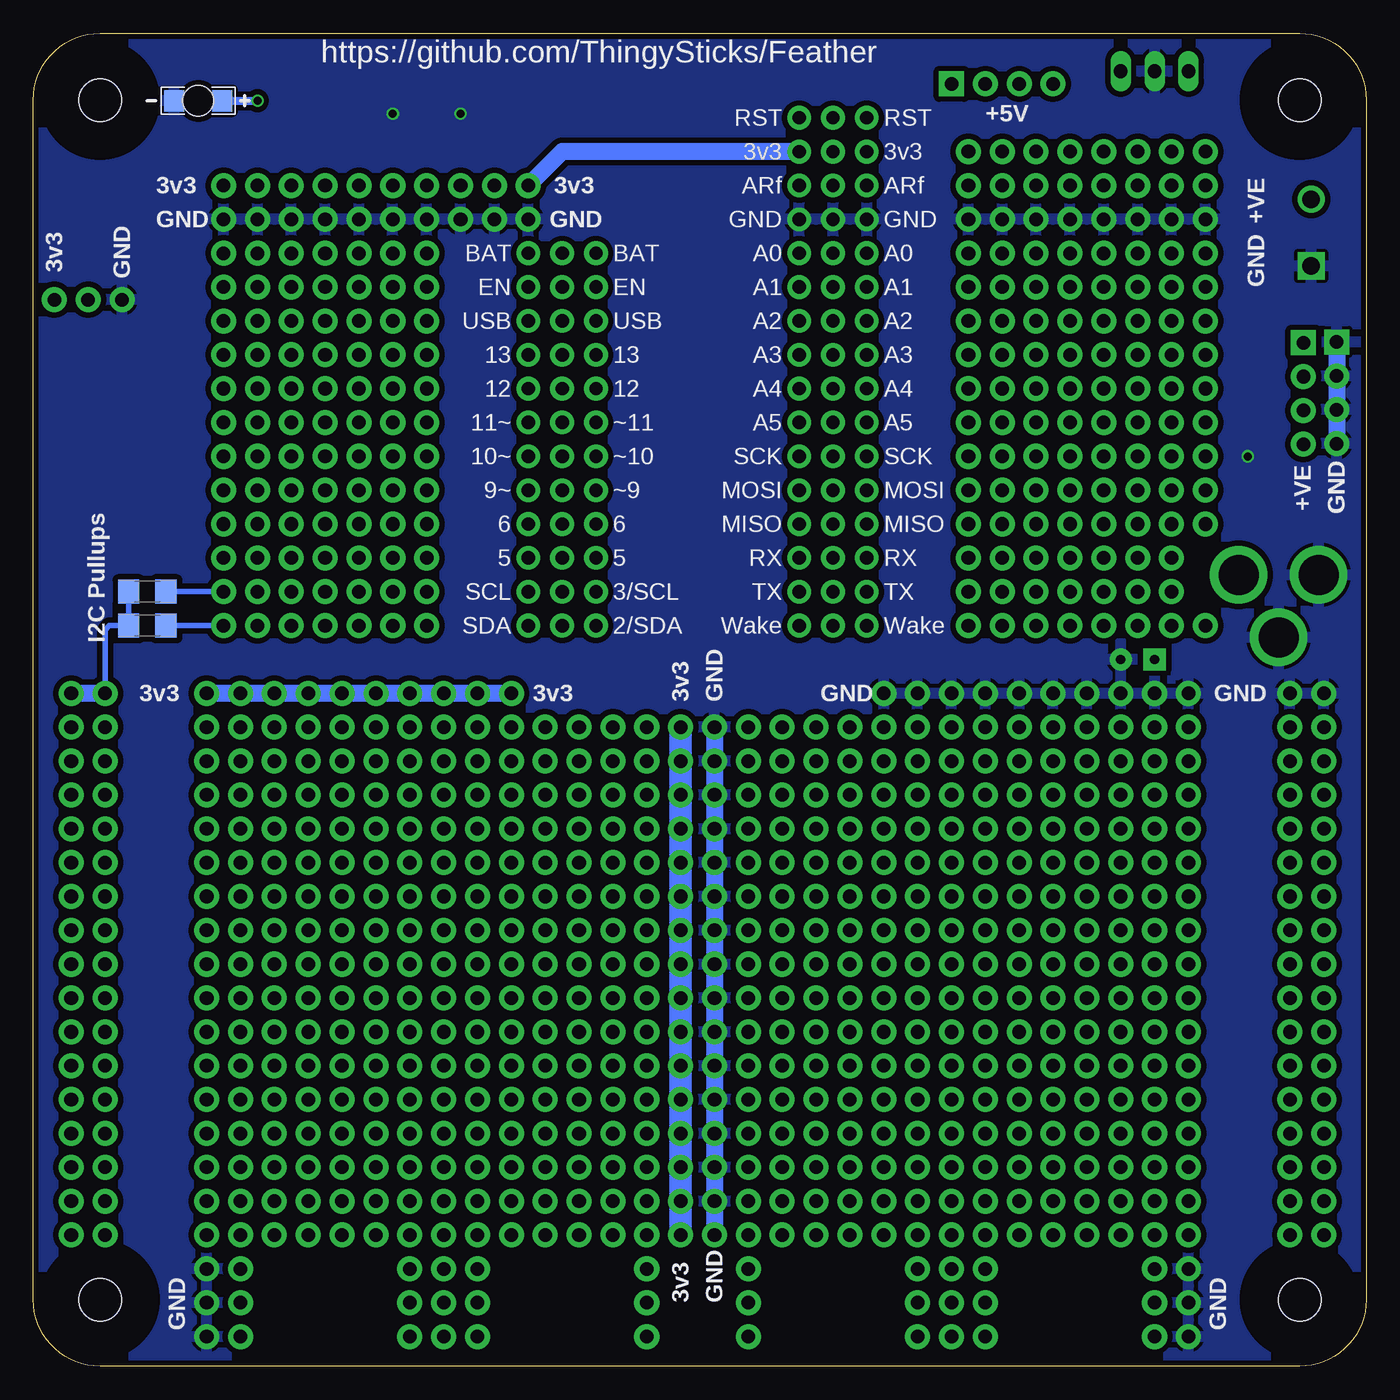
[diagram p3: board, bottom side, seen from below]

Size 100 x 100 mm. Coordinates in mm from the lower left corner, seen from the top.
Outline: 5,0 95,0 arc90 100,5 100,95 arc90 95,100 5,100 arc90 0,95 0,5 arc90 5,0
Copper layers (1*16): Top 0.035mm / dielectric 1.5mm / Bottom 0.035mm
Design rules "dirt_cheap_dirty_boards.v1": minimum track width 5mil, minimum drill 12mil, track to track 5mil, track to pad 5mil, pad to pad 5mil, via to via 5mil, smd to smd 0mil, copper to edge 10mil, drill to drill 10mil, minimum pad ring 10mil, minimum via ring 6mil, stop-mask expansion 2mil, vias tented up to drill 25mil, thermal gap 10mil

### Footprints (pad centres in the part's own frame; a part is rotated, then mirrored left to right if it is on the bottom)
1206 = smd 1.6 x 1.8: 1 -1.4,0; 2 1.4,0
EIA7343 = smd 2.55 x 2.7: A 3.17,0; C -3.17,0
CPOL-RADIAL-100UF-25V = drill 0.7 pad 1.651 square: 1 1.27,0 | drill 0.7 pad 1.651: 2 -1.27,0
LED-1206-BOTTOM = smd 1.5 x 1.6: A -1.8,0; C 1.8,0 | hole 2.3: 0,0
SMA-DIODE_ALT = smd 2 x 2: A -2,0; C 2,0
3,2 = hole 3.2: 0,0
78XXS = drill 1.016 long: GND 0,-2.54; IN -2.54,-2.54; OUT 2.54,-2.54
1X07 = drill 1.016 pad 1.88: 1 0,0; 2 2.54,0; 3 5.08,0; 4 7.62,0; 5 10.16,0; 6 12.7,0; 7 15.24,0
1X04 = drill 1.016 pad 1.88 square: 1 0,0 | drill 1.016 pad 1.88: 2 2.54,0; 3 5.08,0; 4 7.62,0
SCREWTERMINAL-5MM-2 = drill 1.3 pad 2.032 square: 1 0,0 | drill 1.3 pad 2.032: 2 5,0
1X10 = drill 1.016 pad 1.88: 1 0,0; 2 2.54,0; 3 5.08,0; 4 7.62,0; 5 10.16,0; 6 12.7,0; 7 15.24,0; 8 17.78,0; 9 20.32,0; 10 22.86,0
1X02 = drill 1.016 pad 1.88: 1 0,0; 2 2.54,0
1X08_ROUND = drill 1.016 pad 1.88: 1 0,0; 2 2.54,0; 3 5.08,0; 4 7.62,0; 5 10.16,0; 6 12.7,0; 7 15.24,0; 8 17.78,0
1X16 = drill 1.016 pad 1.88: 1 0,0; 2 2.54,0; 3 5.08,0; 4 7.62,0; 5 10.16,0; 6 12.7,0; 7 15.24,0; 8 17.78,0; 9 20.32,0; 10 22.86,0; 11 25.4,0; 12 27.94,0; 13 30.48,0; 14 33.02,0; 15 35.56,0; 16 38.1,0
1X01 = drill 1.016 pad 1.88: 1 0,0
1X14_CONNECTED = drill 1.016 pad 1.88: 1 0,0; 2 2.54,0; 3 5.08,0; 4 7.62,0; 5 10.16,0; 6 12.7,0; 7 15.24,0; 8 17.78,0; 9 20.32,0; 10 22.86,0; 11 25.4,0; 12 27.94,0; 13 30.48,0; 14 33.02,0
1X14_NO_SILK = drill 1.016 pad 1.88: 1 0,0; 2 2.54,0; 3 5.08,0; 4 7.62,0; 5 10.16,0; 6 12.7,0; 7 15.24,0; 8 17.78,0; 9 20.32,0; 10 22.86,0; 11 25.4,0; 12 27.94,0; 13 30.48,0; 14 33.02,0
1X16_NO_SILK = drill 1.016 pad 1.88: 1 0,0; 2 2.54,0; 3 5.08,0; 4 7.62,0; 5 10.16,0; 6 12.7,0; 7 15.24,0; 8 17.78,0; 9 20.32,0; 10 22.86,0; 11 25.4,0; 12 27.94,0; 13 30.48,0; 14 33.02,0; 15 35.56,0; 16 38.1,0
1X03 = drill 1.016 pad 1.88: 1 0,0; 2 2.54,0; 3 5.08,0
POWER_JACK_PTH = drill 2.997 pad 4.318: GND 0,7.7; GNDBREAK 4.7,10.7; PWR 0,13.7
1X04_NO_SILK_ALL_ROUND = drill 1.016 pad 1.88: 1 0,0; 2 2.54,0; 3 5.08,0; 4 7.62,0
FEATHERWING_BREAKOUT = drill 1 pad 1.778: 1 6.35,1.27; 2 8.89,1.27; 3 11.43,1.27; 4 13.97,1.27; 5 16.51,1.27; 6 19.05,1.27; 7 21.59,1.27; 8 24.13,1.27; 9 26.67,1.27; 10 29.21,1.27; 11 31.75,1.27; 12 34.29,1.27; 13 36.83,1.27; 14 39.37,1.27; 15 41.91,1.27; 16 44.45,1.27; 17 44.45,21.59; 18 41.91,21.59; 19 39.37,21.59; 20 36.83,21.59; 21 34.29,21.59; 22 31.75,21.59; 23 29.21,21.59; 24 26.67,21.59; 25 24.13,21.59; 26 21.59,21.59; 27 19.05,21.59; 28 16.51,21.59; #1 6.35,3.81; #2 8.89,3.81; #3 11.43,3.81; #4 13.97,3.81; #5 16.51,3.81; #6 19.05,3.81; #7 21.59,3.81; #8 24.13,3.81; #9 26.67,3.81; #10 29.21,3.81; #11 31.75,3.81; #12 34.29,3.81; #13 36.83,3.81; #14 39.37,3.81; #15 41.91,3.81; #16 44.45,3.81; #17 44.45,19.05; #18 41.91,19.05; #19 39.37,19.05; #20 36.83,19.05; #21 34.29,19.05; #22 31.75,19.05; #23 29.21,19.05; #24 26.67,19.05; #25 24.13,19.05; #26 21.59,19.05; #27 19.05,19.05; #28 16.51,19.05; @1 6.35,-1.27; @2 8.89,-1.27; @3 11.43,-1.27; @4 13.97,-1.27; @5 16.51,-1.27; @6 19.05,-1.27; @7 21.59,-1.27; @8 24.13,-1.27; @9 26.67,-1.27; @10 29.21,-1.27; @11 31.75,-1.27; @12 34.29,-1.27; @13 36.83,-1.27; @14 39.37,-1.27; @15 41.91,-1.27; @16 44.45,-1.27; @17 44.45,24.13; @19 39.37,24.13; @20 36.83,24.13; @21 34.29,24.13; @22 31.75,24.13; @23 29.21,24.13; @24 26.67,24.13; @25 24.13,24.13; @26 21.59,24.13; @27 19.05,24.13; @28 16.51,24.13; @!8 41.91,24.13
SOT23-3 = smd 0.8 x 0.9: 1 -0.95,-1; 2 0.95,-1; 3 0,1.1
SO08-UNIVERSAL = smd 0.61 x 3.353: 1 -1.905,-3.073; 2 -0.635,-3.073; 3 0.635,-3.073; 4 1.905,-3.073; 5 1.905,3.073; 6 0.635,3.073; 7 -0.635,3.073; 8 -1.905,3.073

### Placement (x,y rotation side)
C1  14.29,93.66 0 top
C2  19.68,93.66 180 top
C3  75.56,92.71 90 top
C4  70.48,92.71 90 top
C5  65.41,92.71 90 top
C6  50.16,2.54 180 top
C9  8.89,73.34 90 top
CAP  17.14,53.02 180 top
D1  87.63,94.93 180 bottom
D2  35.56,96.2 0 top
FRAME1  17.09,-13.32 0 top  (outside the outline)
H1  5,5 0 top
H2  5,95 0 top
H3  95,95 0 top
H4  95,5 0 top
IC1  15.88,99.69 0 top
JP1  70.48,55.56 0 top
JP2  4.71,76.78 270 top
JP3  31.11,96.2 180 top
JP4  4.13,82.55 90 top
JP5  64.14,50.48 0 top
JP6  62.87,88.58 0 top
JP7  70.48,65.72 0 top
JP8  97.16,50.48 180 top
JP9  29.84,86.04 180 top
JP10  70.48,63.18 0 top
JP11  36.2,50.48 180 top
JP12  29.84,88.58 180 top
JP13  51.44,9.84 90 top
JP14  48.9,9.84 90 top
JP15  29.84,83.5 180 top
JP16  98.42,80.01 0 top
JP17  29.84,91.12 180 top
JP18  70.48,60.64 0 top
JP19  70.48,80.96 0 top
JP20  70.48,68.26 0 top
JP21  70.48,70.8 0 top
JP22  70.48,73.34 0 top
JP23  70.48,58.1 0 top
JP24  70.48,78.42 0 top
JP25  70.48,83.5 0 top
JP26  70.48,75.88 0 top
JP27  29.84,58.1 180 top
JP28  29.84,60.64 180 top
JP29  62.87,86.04 0 top
JP30  95.89,80.01 0 top
JP31  3.17,45.4 0 top
JP32  3.17,50.48 0 top
JP33  93.34,80.01 0 top
JP34  94.61,42.86 0 top
JP35  13.34,30.16 0 top
JP36  13.34,47.94 0 top
JP37  87,47.94 180 top
JP38  3.17,42.86 0 top
JP39  94.61,40.32 0 top
JP40  13.34,45.4 0 top
JP41  13.34,42.86 0 top
JP42  13.34,40.32 0 top
JP43  13.34,37.78 0 top
JP44  13.34,35.24 0 top
JP45  13.34,32.7 0 top
JP46  13.34,27.62 0 top
JP47  13.34,25.08 0 top
JP48  13.34,22.54 0 top
JP49  13.34,20 0 top
JP50  13.34,17.46 0 top
JP51  13.34,14.92 0 top
JP52  13.34,12.38 0 top
JP53  13.34,9.84 0 top
JP54  29.84,80.96 180 top
JP55  3.17,47.94 0 top
JP56  87,45.4 180 top
JP57  87,42.86 180 top
JP58  87,40.32 180 top
JP59  87,37.78 180 top
JP60  87,35.24 180 top
JP61  87,32.7 180 top
JP62  87,30.16 180 top
JP63  87,27.62 180 top
JP64  87,25.08 180 top
JP65  87,22.54 180 top
JP66  87,20 180 top
JP67  87,17.46 180 top
JP68  87,14.92 180 top
JP69  87,12.38 180 top
JP70  87,9.84 180 top
JP71  94.61,47.94 0 top
JP72  94.61,45.4 0 top
JP73  94.61,37.78 0 top
JP74  94.61,35.24 0 top
JP75  94.61,32.7 0 top
JP76  94.61,30.16 0 top
JP77  94.61,27.62 0 top
JP78  94.61,25.08 0 top
JP79  94.61,22.54 0 top
JP80  94.61,20 0 top
JP81  94.61,17.46 0 top
JP82  94.61,14.92 0 top
JP83  94.61,12.38 0 top
JP84  94.61,9.84 0 top
JP85  3.17,40.32 0 top
JP86  3.17,37.78 0 top
JP87  3.17,35.24 0 top
JP88  3.17,32.7 0 top
JP89  3.17,30.16 0 top
JP90  3.17,27.62 0 top
JP91  3.17,25.08 0 top
JP92  3.17,22.54 0 top
JP93  3.17,20 0 top
JP94  3.17,17.46 0 top
JP95  3.17,14.92 0 top
JP96  3.17,12.38 0 top
JP97  3.17,9.84 0 top
JP98  29.84,78.42 180 top
JP99  29.84,75.88 180 top
JP100  29.84,73.34 180 top
JP101  29.84,70.8 180 top
JP102  29.84,68.26 180 top
JP103  29.84,65.72 180 top
JP104  29.84,63.18 180 top
JP105  13.34,2.22 90 top
JP106  87,2.22 90 top
JP107  29.84,55.56 180 top
JP108  31.11,2.22 90 top
JP109  2.22,76.83 270 top
JP110  -4.13,59.37 270 top
JP111  66.67,7.3 270 top
JP112  46.35,7.3 270 top
JP113  71.75,2.22 90 top
JP114  84.45,9.84 270 top
JP115  28.57,9.84 270 top
JP116  53.98,2.22 90 top
JP117  33.66,2.22 90 top
JP118  15.88,2.22 90 top
JP119  69.22,2.22 90 top
LOGO1  5,5 0 top
LOGO2  95,5 0 top
LOGO3  87.63,94.93 0 top
MS2  38.73,100.01 270 top
Q1  57.78,4.76 90 top
Q2  62.87,4.76 270 top
Q3  37.47,4.76 90 top
Q4  42.55,4.76 270 top
R1  83.19,92.71 270 top
R10  91.12,75.88 0 top
R11  96.84,75.88 0 top
R12  91.12,73.34 0 top
R13  96.84,73.34 0 top
R14  91.12,70.8 0 top
R15  96.84,70.8 0 top
R16  91.12,68.26 0 top
R17  96.84,68.26 0 top
R18  91.12,65.72 0 top
R19  96.84,65.72 0 top
R20  91.12,63.18 0 top
R21  96.84,63.18 0 top
R22  91.12,60.64 0 top
R23  96.84,60.64 0 top
R24  91.12,58.1 0 top
R25  96.84,58.1 180 top
R26  91.12,55.56 0 top
R27  96.84,55.56 180 top
R30  9.84,47.94 180 top
R31  9.84,45.4 180 top
R32  9.84,42.86 180 top
R33  9.84,40.32 180 top
R34  9.84,37.78 180 top
R35  9.84,35.24 180 top
R36  9.84,32.7 180 top
R37  9.84,30.16 180 top
R38  9.84,27.62 180 top
R39  9.84,25.08 180 top
R40  9.84,22.54 180 top
R41  9.84,20 180 top
R42  9.84,17.46 180 top
R43  9.84,14.92 180 top
R44  9.84,12.38 180 top
R45  9.84,9.84 180 top
R46  90.49,47.94 0 top
R47  90.49,45.4 0 top
R48  90.49,42.86 0 top
R49  90.49,40.32 0 top
R50  90.49,37.78 0 top
R51  90.49,35.24 0 top
R52  90.49,32.7 0 top
R53  90.49,30.16 0 top
R54  90.49,27.62 0 top
R55  90.49,25.08 0 top
R56  90.49,22.54 0 top
R57  90.49,20 0 top
R58  90.49,17.46 0 top
R59  90.49,14.92 0 top
R60  90.49,12.38 0 top
R61  90.49,9.84 0 top
R62  91.44,58.1 180 bottom
R63  91.44,55.56 180 bottom
U1  78.11,5.4 270 top
U4  22.23,5.4 270 top

### Tracks (layer width: path | path; a pad name or v marks a point on that pad's centre or on a via)
3.3V
  Top 0.305: JP119.3 67.94,8.57 51.75,8.57 51.44,8.26 | JP108.1 32.7,0.64 50.8,0.64 51.44,1.27 51.44,2.41 C6.1
  Top 0.406: JP108.3 JP108.2 JP108.1 | JP119.1 JP119.2 JP119.3 JP119.1
  Top 0.61: 51.06,48.31 JP13.16 | JP13.1 51.44,8.26 51.44,2.91 C6.1 | C5.1 JP6.2 | C4.1 JP6.4 | C3.1 JP6.6
  Top 0.813: R1.2 JP6.9
  Top 1.016: JP8.2 JP5.10
  Top 1.27: JP6.1 JP6.2 JP6.3 JP6.4 JP6.5 JP6.6 JP6.7 JP6.8 JP6.9 JP6.10 97.47,88.58 98.42,87.63 JP16.1 | JP5.1 JP5.2 JP5.3 JP5.4 JP5.5 JP5.6 JP5.7 JP5.8 JP5.9 JP5.10 | JP17.8 JP17.7 JP17.6 JP17.5 JP17.4 JP17.3 JP17.2 JP17.1 MS2.@2 MS2.2 MS2.#2
  Top 1.676: JP13.1 JP13.2 JP13.3 JP13.4 JP13.5 JP13.6 JP13.7 JP13.8 JP13.9 JP13.10 JP13.11 JP13.12 JP13.13 JP13.14 JP13.15 JP13.16 51.44,50.8 | 51.44,50.8 51.44,87.31 47.62,91.12 MS2.2 | JP5.1 51.75,50.48 51.44,50.8
  Bottom 0.406: R62.2 R63.2 94.3,55.56 94.61,55.24 JP8.2 | 51.44,9.21 JP13.1
  Bottom 1.27: JP8.2 JP8.1 | JP5.1 JP5.10 | MS2.#2 60.33,91.12 JP6.1
  Bottom 1.676: JP13.1 JP13.16
12V
  Top 0.61: C1.1 11.11,93.66
  Top 1.016: CAP.1 10.16,53.02 9.53,53.66 9.53,59.33 | 7.98,76.78 8.09,76.67 C9.A
  Top 1.27: 4.21,87.63 JP4.2 | 8.84,76.78 8.89,76.83 8.94,76.79 | JP2.1 JP2.2 JP2.3 JP2.4
  Top 1.676: IC1.IN 13.34,95.89 11.11,93.66 8.89,91.44 8.89,87 | 8.89,87 8.26,87.63 4.21,87.63 | JP2.4 4.76,69.11 4.76,66.99 5.71,66.04 8.26,66.04 9.57,64.72 JP110.PWR 9.53,59.33 | 8.89,87 8.89,77.47 8.57,77.15 | 8.21,76.78 8.09,76.67 | JP2.1 8.21,76.78 | 8.21,76.78 8.57,77.15 | 8.89,76.83 8.57,77.15
A0
  Top 0.813: MS2.#5 MS2.5 MS2.@5 JP15.1 JP15.2 JP15.3 JP15.4 JP15.5 JP15.6 JP15.7 JP15.8
A1
  Top 0.813: MS2.#6 MS2.6 MS2.@6 JP54.1 JP54.2 JP54.3 JP54.4 JP54.5 JP54.6 JP54.7 JP54.8
A2
  Top 0.813: MS2.#7 MS2.7 MS2.@7 JP98.1 JP98.2 JP98.3 JP98.4 JP98.5 JP98.6 JP98.7 JP98.8
A3
  Top 0.813: MS2.#8 MS2.8 MS2.@8 JP99.1 JP99.2 JP99.3 JP99.4 JP99.5 JP99.6 JP99.7 JP99.8
A4
  Top 0.813: MS2.#9 MS2.9 MS2.@9 JP100.1 JP100.2 JP100.3 JP100.4 JP100.5 JP100.6 JP100.7 JP100.8
A5
  Top 0.813: MS2.#10 MS2.10 MS2.@10 JP101.1 JP101.2 JP101.3 JP101.4 JP101.5 JP101.6 JP101.7 JP101.8
AREF
  Top 0.813: MS2.#3 MS2.3 MS2.@3 JP12.1 JP12.2 JP12.3 JP12.4 JP12.5 JP12.6 JP12.7 JP12.8
D5
  Top 0.813: MS2.#19 MS2.19 MS2.@19 JP18.1 JP18.2 JP18.3 JP18.4 JP18.5 JP18.6 JP18.7 R22.1
D6
  Top 0.813: MS2.#20 MS2.20 62.23,63.18 MS2.@20 JP10.1 JP10.2 JP10.3 JP10.4 JP10.5 JP10.6 JP10.7 R20.1
D9
  Top 0.813: MS2.#21 MS2.21 MS2.@21 JP7.1 JP7.2 JP7.3 JP7.4 JP7.5 JP7.6 JP7.7 R18.1
D10
  Top 0.813: MS2.#22 MS2.22 MS2.@22 JP20.1 JP20.2 JP20.3 JP20.4 JP20.5 JP20.6 JP20.7 R16.1
D11
  Top 0.813: MS2.#23 MS2.23 MS2.@23 JP21.1 JP21.2 JP21.3 JP21.4 JP21.5 JP21.6 JP21.7 R14.1
D12
  Top 0.813: MS2.#24 MS2.24 MS2.@24 JP22.1 JP22.2 JP22.3 JP22.4 JP22.5 JP22.6 JP22.7 R12.1
D13
  Top 0.813: MS2.#25 MS2.25 MS2.@25 JP26.1 JP26.2 JP26.3 JP26.4 JP26.5 JP26.6 JP26.7 R10.1
EN
  Top 0.813: MS2.#27 MS2.27 MS2.@27 JP19.1 JP19.2 JP19.3 JP19.4 JP19.5 JP19.6 JP19.7
GND  (via drill 0.6)
  Top 0.61: 49.27,48.31 JP14.16 | JP14.1 48.9,2.91 C6.2 | C5.2 67.81,94.11 v67.94,93.98 68.08,94.11 C4.2 C3.2
  Top 0.813: 15.82,93.8 15.82,97.1 IC1.GND
  Top 1.016: C2.2 C1.2 15.82,93.8 | C9.C v8.89,68.26
  Top 1.676: JP14.1 JP14.2 JP14.3 JP14.4 JP14.5 JP14.6 JP14.7 JP14.8 JP14.9 JP14.10 JP14.11 JP14.12 JP14.13 JP14.14 JP14.15 JP14.16 48.9,49.53 47.94,50.48 JP11.1 JP11.2 JP11.3 JP11.4 JP11.5 JP11.6 JP11.7 JP11.8 JP11.9 JP11.10
  Bottom 1.27: JP14.16 JP14.1 | JP109.1 JP109.4
  other vias: 73.03,93.98
  pour Bottom (isolate 0.406, rank 5): -0.64,100.33 100.33,100.33 100.33,-0.64 -0.64,-0.64
LED_COMMON
  Top 0.813: R27.1 R25.1 R23.2 R21.2 R19.2 R17.2 98.42,68.26 98.42,68.58 98.24,68.58 R15.2 R13.2 R11.2 98.11,76.01 98.11,77.15 95.89,79.38 JP30.1
MISO
  Top 0.813: MS2.#13 MS2.13 MS2.@13 JP104.1 JP104.2 JP104.3 JP104.4 JP104.5 JP104.6 JP104.7 JP104.8
MOSI
  Top 0.813: MS2.#12 MS2.12 MS2.@12 JP103.1 JP103.2 | JP103.8 JP103.7 JP103.6 JP103.5 JP103.4 JP103.3 JP103.2 | JP103.2 29.53,65.72 29.84,65.41 29.84,66.04
N$1  (via drill 0.6)
  Top 0.61: v83.19,94.93 R1.1
  Bottom 0.61: D1.A v83.19,94.93
N$2
  Top 0.61: JP113.4 74.3,7.3 U1.1
N$3
  Top 0.61: U1.2 73.03,6.03 JP113.3
N$6
  Top 0.813: R10.2 R11.1
N$7
  Top 0.61: JP113.2 U1.3
N$8
  Top 0.61: JP113.1 73.03,3.49 U1.4
N$9
  Top 0.61: JP114.1 81.92,7.3 U1.8
N$12
  Top 0.61: U1.7 83.19,6.03 JP114.2
N$13
  Top 0.813: R13.1 R12.2
N$14
  Top 0.813: R14.2 R15.1
N$15
  Top 0.813: R17.1 R16.2
N$16
  Top 0.61: U1.6 JP114.3
N$17
  Top 0.61: U1.5 83.19,3.49 JP114.4
N$18
  Top 0.61: JP112.3 42.23,2.22 41.59,2.86 41.59,3.77 Q4.2
N$19
  Top 0.813: R18.2 R19.1
N$20
  Top 0.61: Q1.3 JP116.2
N$21
  Top 0.813: R21.1 R20.2
N$22
  Top 0.61: JP116.1 58.1,2.22 58.74,2.86 58.74,3.77 Q1.1
N$23
  Top 0.813: R22.2 R23.1
N$25
  Top 0.813: R46.2 JP71.1 JP71.2
N$26
  Top 0.61: Q1.2 58.78,6.62 58.1,7.3 JP116.3
N$27
  Top 0.813: R26.2 R27.2
N$29
  Top 0.813: R25.2 R24.2
N$30
  Top 0.61: Q3.3 JP117.2
N$31
  Top 0.813: R47.2 JP72.1 JP72.2
N$32
  Top 0.813: JP34.2 JP34.1 R48.2
N$33
  Top 0.813: R49.2 JP39.1 JP39.2
N$34
  Top 0.813: JP73.2 JP73.1 R50.2
N$35
  Top 0.813: JP74.2 JP74.1 R51.2
N$36
  Top 0.813: JP75.2 JP75.1 R52.2
N$37
  Top 0.813: JP76.2 JP76.1 R53.2
N$38
  Top 0.813: JP77.2 JP77.1 R54.2
N$39
  Top 0.813: JP78.2 JP78.1 R55.2
N$40
  Top 0.813: JP79.2 JP79.1 R56.2
N$41
  Top 0.813: JP80.2 JP80.1 R57.2
N$42
  Top 0.813: JP81.2 JP81.1 R58.2
N$43
  Top 0.813: JP82.2 JP82.1 R59.2
N$44
  Top 0.813: JP83.2 JP83.1 R60.2
N$45
  Top 0.813: JP84.2 JP84.1 R61.2
N$46
  Top 0.813: JP70.1 R61.1
N$47
  Top 0.813: R60.1 JP69.1
N$48
  Top 0.813: JP68.1 R59.1
N$49
  Top 0.813: R58.1 JP67.1
N$50
  Top 0.813: JP66.1 R57.1
N$51
  Top 0.813: R56.1 JP65.1
N$52
  Top 0.813: JP64.1 R55.1
N$53
  Top 0.813: R54.1 JP63.1
N$54
  Top 0.813: JP62.1 R53.1
N$55
  Top 0.813: R52.1 JP61.1
N$56
  Top 0.813: JP60.1 R51.1
N$57
  Top 0.813: R50.1 JP59.1
N$58
  Top 0.813: JP58.1 R49.1
N$59
  Top 0.813: R48.1 JP57.1
N$60
  Top 0.813: JP56.1 R47.1
N$61
  Top 0.813: JP37.1 R46.1
N$62
  Top 0.813: R45.2 JP97.2 JP97.1
N$63
  Top 0.813: JP96.1 JP96.2 R44.2
N$64
  Top 0.813: R43.2 JP95.2 JP95.1
N$65
  Top 0.813: JP94.1 JP94.2 R42.2
N$66
  Top 0.813: R41.2 JP93.2 JP93.1
N$67
  Top 0.813: JP92.1 JP92.2 R40.2
N$68
  Top 0.813: JP91.1 JP91.2 R39.2
N$69
  Top 0.813: R38.2 JP90.2 JP90.1
N$70
  Top 0.813: JP89.1 JP89.2 R37.2
N$71
  Top 0.813: R36.2 JP88.2 JP88.1
N$72
  Top 0.813: JP87.1 JP87.2 R35.2
N$73
  Top 0.813: R34.2 JP86.2 JP86.1
N$74
  Top 0.813: JP85.1 JP85.2 R33.2
N$75
  Top 0.813: R32.2 JP38.2 JP38.1
N$76
  Top 0.813: JP55.1 JP55.2 R30.2
N$77
  Top 0.813: R30.1 JP36.1
N$78
  Top 0.813: JP40.1 R31.1
N$79
  Top 0.813: R32.1 JP41.1
N$80
  Top 0.813: JP42.1 R33.1
N$81
  Top 0.813: R34.1 JP43.1
N$82
  Top 0.813: JP44.1 R35.1
N$83
  Top 0.813: R36.1 JP45.1
N$84
  Top 0.813: R37.1 JP35.1
N$85
  Top 0.813: JP46.1 R38.1
N$86
  Top 0.813: R39.1 JP47.1
N$87
  Top 0.813: JP48.1 R40.1
N$88
  Top 0.813: R41.1 JP49.1
N$89
  Top 0.813: JP50.1 R42.1
N$90
  Top 0.813: R43.1 JP51.1
N$91
  Top 0.813: JP52.1 R44.1
N$92
  Top 0.813: JP53.1 R45.1
N$93
  Top 0.813: JP31.1 JP31.2 R31.2
N$95
  Top 0.61: JP117.1 37.78,2.22 38.42,2.86 38.42,3.77 Q3.1
N$96
  Top 0.61: Q3.2 38.47,6.62 37.78,7.3 JP117.3
N$97
  Top 0.61: JP118.4 18.41,7.3 U4.1
N$98
  Top 0.61: U4.2 17.14,6.03 JP118.3
N$104
  Top 0.61: U4.3 JP118.2
N$128
  Top 0.61: U4.4 17.14,3.49 JP118.1
N$129
  Top 0.61: U4.8 26.04,7.3 | 26.04,7.3 26.67,7.3 | JP115.1 26.04,7.3
N$130
  Top 0.61: U4.7 27.3,6.03 JP115.2
N$131
  Top 0.61: U4.6 JP115.3
N$132
  Top 0.61: U4.5 27.3,3.49 JP115.4
N$134
  Top 0.61: Q4.3 JP112.2
N$135
  Top 0.61: Q4.1 41.55,6.62 42.23,7.3 JP112.1
N$138
  Top 0.61: JP111.2 Q2.3
N$139
  Top 0.61: Q2.1 61.87,6.62 62.55,7.3 JP111.1
N$140
  Top 0.61: Q2.2 61.87,2.9 62.55,2.22 JP111.3
RESET
  Top 0.813: MS2.@1 MS2.1 MS2.#1
RX
  Top 0.813: MS2.#14 MS2.14 MS2.@14 JP28.1 JP28.2 JP28.3 JP28.4 JP28.5 JP28.6 JP28.7
SCK
  Top 0.813: MS2.#11 MS2.11 MS2.@11 JP102.1 JP102.2 JP102.3 JP102.4 JP102.5 JP102.6 JP102.7 JP102.8
SCL
  Top 0.813: R24.1 JP23.7 JP23.6 JP23.5 JP23.4 JP23.3 JP23.2 JP23.1 MS2.@!8 MS2.18 MS2.#18
  Bottom 0.406: R62.1 JP23.7
SDA
  Top 0.813: R26.1 JP1.7 JP1.6 JP1.5 JP1.4 JP1.3 JP1.2 JP1.1 MS2.@17 MS2.17 MS2.#17
  Bottom 0.406: R63.1 JP1.7
TX
  Top 0.813: MS2.#15 MS2.15 MS2.@15 JP27.1 JP27.2 JP27.3 JP27.4 JP27.5 JP27.6 JP27.7
USB
  Top 0.813: JP24.1 JP24.2 JP24.3 JP24.4 JP24.5 JP24.6 JP24.7
  Top 1.676: D2.C 53.02,96.2 54.61,94.61 54.61,80.33 56.52,78.42 MS2.#26 MS2.26 MS2.@26 JP24.1
VBAT
  Top 0.813: MS2.#28 MS2.28 MS2.@28 JP25.1 JP25.2 JP25.3 JP25.4 JP25.5 JP25.6 JP25.7
VIN
  Top 0.813: C2.1 21.09,97.03 20.95,97.16
  Top 1.676: IC1.OUT 20.95,97.16 22.23,97.16 23.18,96.2 JP3.4 JP3.3 JP3.2 JP3.1 D2.A
WAKE
  Top 0.813: MS2.#16 MS2.16 MS2.@16 JP107.1 JP107.2 JP107.3 JP107.4 JP107.5 JP107.6 JP107.7 JP107.8

### Text on the board
tNames: Stephen Harrison | ThingySticks.com/Feather | 25 Feb 2018 | V1.0 | +5V | 3v3 | 3v3 | +VE | +VE | GND | GND | 3v3 | GND | GND | GND | +VE | GND | GND | 3v3 | GND | 3v3 | 3v3 | GND | GND | GND | 3v3
bNames: https://github.com/ThingySticks/Feather | +5V | 3v3 | 3v3 | +VE | GND | GND | 3v3 | GND | GND | GND | GND | +VE | I2C Pullups | GND | GND | GND | 3v3 | 3v3 | 3v3 | GND | GND | GND | 3v3
Document: Stephen Harrison